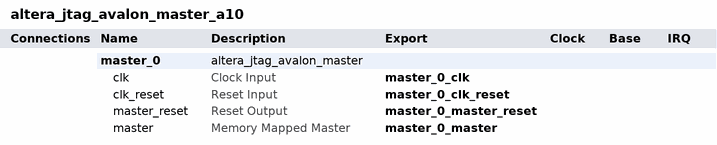
[diagram p0: system contents]
# Platform Designer (Qsys) system altera_jtag_avalon_master_a10, Arria 10 10AX115S4F45I3SGE2
# Parameters at their usual value, and those the tool derives, are not listed.
package require -exact qsys 15.0
create_system altera_jtag_avalon_master_a10
set_project_property DEVICE_FAMILY {Arria 10}
set_project_property DEVICE 10AX115S4F45I3SGE2

add_instance master_0 altera_jtag_avalon_master 15.0

# exported interfaces
add_interface master_0_clk clock sink
set_interface_property master_0_clk EXPORT_OF master_0.clk
add_interface master_0_clk_reset reset sink
set_interface_property master_0_clk_reset EXPORT_OF master_0.clk_reset
add_interface master_0_master avalon master
set_interface_property master_0_master EXPORT_OF master_0.master
add_interface master_0_master_reset reset source
set_interface_property master_0_master_reset EXPORT_OF master_0.master_reset

set_interconnect_requirement {$system} qsys_mm.clockCrossingAdapter HANDSHAKE
set_interconnect_requirement {$system} qsys_mm.maxAdditionalLatency 1

save_system altera_jtag_avalon_master_a10.qsys
